# Altium schematic sheet BMS Carrier - Temperature Sense Interface.SchDoc: Current Sense isoSPI Interface
size Letter; Author: Taiping Li; Revision: 2.1; Website: www.uwmidsun.com; ProjectAuthor: Taiping Li
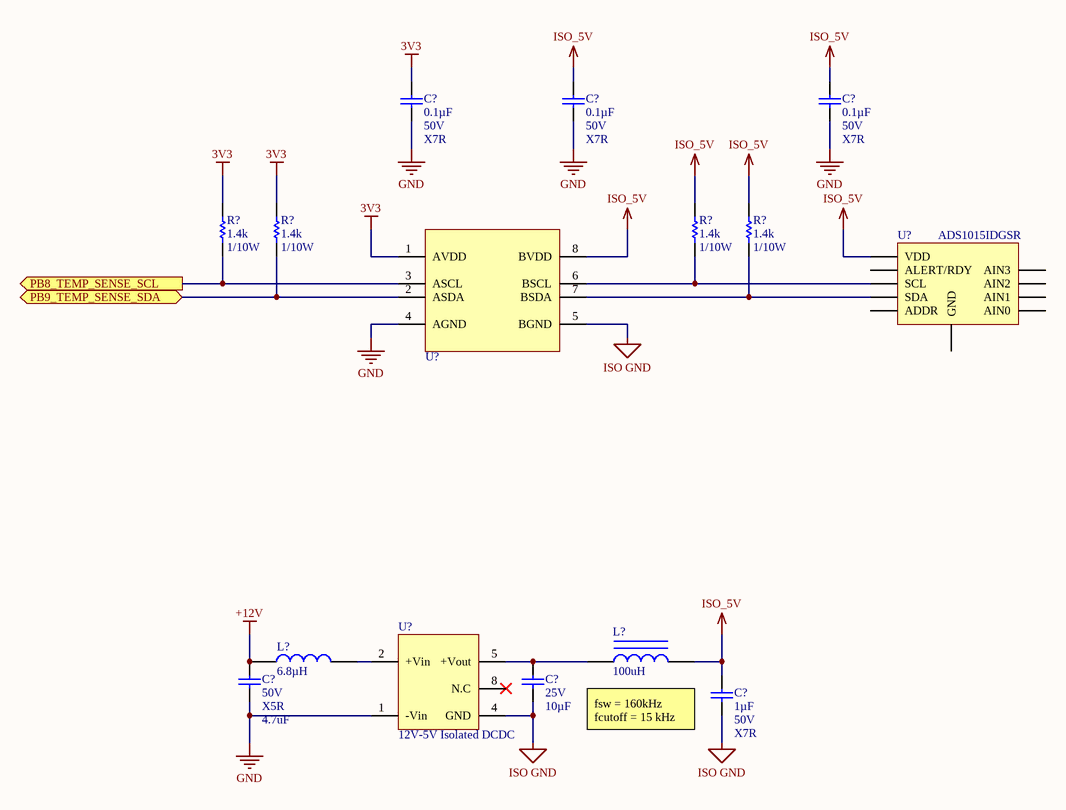
[diagram p0: BMS Carrier - Temperature Sense Interface.SchDoc]

## Parts
(Parts that share a designator on the sheet are numbered #1, #2 ... from top to bottom, then left to right.)
C?#1  Capacitance: 0.1µF  Voltage: 50V  Temperature Coefficient: X7R  [CAP, 0603]  (hidden comment: CAP CER 0.1UF 50V 10% X7R 0603)
C?#2  Capacitance: 0.1µF  Voltage: 50V  Temperature Coefficient: X7R  [CAP, 0603]  (hidden comment: CAP CER 0.1UF 50V 10% X7R 0603)
C?#3  Capacitance: 0.1µF  Voltage: 50V  Temperature Coefficient: X7R  [CAP, 0603]  (hidden comment: CAP CER 0.1UF 50V 10% X7R 0603)
C?#4  value 4.7uF  Voltage - Rated: 50V  Temperature Coefficient: X5R  [CAP, 0805]  (hidden comment: CAP CER 4.7UF 50V 10% X5R 0805)
C?#5  Voltage - Rated: 25V  Capacitance: 10µF  [CAP, 0805]  (hidden comment: CAP CER 10uF 25V 10% X5R 0805)
C?#6  Capacitance: 1µF  Voltage: 50V  Temperature Coefficient: X7R  [CAP, 0603]  (hidden comment: CAP CER 1UF 50V 10% X7R 0603)
L?#1  Inductance: 6.8µH  [NLFV32T-6R8M-EF/IND 6.8uH]  (hidden comment: IND 6.8uH 260mA 20% 1210)
L?#2  value 100uH  [1210]  (hidden comment: IND 100uH 60mA 5% 1210)
R?#1  Resistance: 1.4k  Power: 1/10W  [RES, 0603]  (hidden comment: RES 1.4k OHM 1% 1/10W 0603)
R?#2  Resistance: 1.4k  Power: 1/10W  [RES, 0603]  (hidden comment: RES 1.4k OHM 1% 1/10W 0603)
R?#3  Resistance: 1.4k  Power: 1/10W  [RES, 0603]  (hidden comment: RES 1.4k OHM 1% 1/10W 0603)
R?#4  Resistance: 1.4k  Power: 1/10W  [RES, 0603]  (hidden comment: RES 1.4k OHM 1% 1/10W 0603)
U?#1  IC DGTL ISO I2C 3.75KV 2CH 8SOIC  [IC DGTL ISO 3.75KV I2C 8SOIC NARROW BODY]  (value not drawn)
U?#2  ADS1015IDGSR  [IC ADC VSSOP10]
U?#3  12V-5V Isolated DCDC  [IC, Isolated DCDC]

## Ports
PB8_TEMP_SENSE_SCL (out), PB9_TEMP_SENSE_SDA (bidir)

## Nets
3V3: C?#1.1 R?#1.1 R?#2.1 U?#1.1(AVDD)
+12V: C?#4.1 L?#1.1
GND: C?#1.2 C?#2.2 C?#3.2 C?#4.2 U?#1.4(AGND) U?#3.1(-Vin)
ISO GND: C?#5.2 C?#6.2 U?#1.5(BGND) U?#3.4(GND)
ISO_5V: C?#2.1 C?#3.1 C?#6.1 L?#2.2 R?#3.1 R?#4.1 U?#1.8(BVDD) U?#2.8(VDD)
PB8_TEMP_SENSE_SCL: R?#1.2 U?#1.3(ASCL) ; port PB8_TEMP_SENSE_SCL
PB9_TEMP_SENSE_SDA: R?#2.2 U?#1.2(ASDA) ; port PB9_TEMP_SENSE_SDA
NetC?#5_1: C?#5.1 L?#2.1 U?#3.5(+Vout)
NetL?#1_2: L?#1.2 U?#3.2(+Vin)
NetR?#3_2: R?#3.2 U?#1.6(BSCL) U?#2.10(SCL)
NetR?#4_2: R?#4.2 U?#1.7(BSDA) U?#2.9(SDA)

Not connected (* = marked no-connect by the designer): U?#2 1(ADDR) 2(ALERT/RDY) 3(GND) 4(AIN0) 5(AIN1) 6(AIN2) 7(AIN3); U?#3 8(N.C)*

## Notes on the sheet
- fsw = 160kHz
  fcutoff = 15 kHz
- Project:
- Title:
- Size:
- Project Lead:
- Letter
- Revision:
- University of Waterloo
- 200 University Ave W
- Waterloo, ON, Canada
- N2L 3E9
- Date:
- Sheet
- of
- Website:

## Library data of the parts
C?#1-C?#3 = CAP CER 0.1UF 50V 10% X7R 0603: 0.10µF ±10% 50V Ceramic Capacitor X7R 0603 (1608 Metric); Manufacturer 1: AVX Corporation; Manufacturer Part Number 1: 06035C104KAT2A; Supplier 1: Digi-Key; Supplier Part Number 1: 478-5052-1-ND; Packaging: Cut Tape (CT); Part Status: Active; Operating Temperature: -55°C ~ 125°C; Ratings: -; Mounting Type: Surface Mount, MLCC; Package / Case: 0603 (1608 Metric); Size / Dimension: 0.063" L x 0.032" W (1.60mm x 0.81mm); Height - Seated (Max): -; Thickness (Max): 0.035" (0.90mm); Lead Spacing: -; Lead Style: -; ComponentLink1URL: http://datasheets.avx.com/X7RDielectric.pdf; ComponentLink1Description: http://datasheets.avx.com/X7RDielectric.pdf; Tolerance: ±10%
C?#4 = CAP CER 4.7UF 50V 10% X5R 0805: 4.7µF ±20% 50V Ceramic Capacitor X5R 0805 (2012 Metric); Manufacturer 1: Murata Electronics North America; Manufacturer Part Number 1: GRT21BR61H475ME13L; Description 1: CAP CER 4.7UF 50V X5R 0805; Supplier 1: Digi-Key; Supplier Part Number 1: 490-12395-1-ND; RoHS: RoHS Compliant; Category: Capacitors; Stock 1: 4286; Pricing 1: 1=0.56, 10=0.389, 100=0.2338, 500=0.17536, 1000=0.14808 (CAD); Packaging: Cut Tape (CT); Part Status: Active; Tolerance: ±20%; Operating Temperature: -55°C ~ 85°C; Features: -; Ratings: AEC-Q200; Applications: Automotive; Mounting Type: Surface Mount, MLCC; Package / Case: 0805 (2012 Metric); Size / Dimension: 0.079" L x 0.049" W (2.00mm x 1.25mm); Height - Seated (Max): -; Thickness (Max): 0.057" (1.45mm); Lead Spacing: -; Lead Style: -; ComponentLink1URL: http://search.murata.co.jp/Ceramy/image/img/A01X/G101/ENG/GRT21BR61H475ME13-01.pdf; ComponentLink1Description: http://search.murata.co.jp/Ceramy/image/img/A01X/G101/ENG/GRT21BR61H475ME13-01.pdf
C?#5 = CAP CER 10uF 25V 10% X5R 0805: 10µF ±10% 25V Ceramic Capacitor X5R 0805 (2012 Metric); Manufacturer: Murata Electronics North America; Manufacturer Part Number: GRM21BR61E106KA73L; Supplier 1: Digi-Key; RoHS: RoHS Compliant; Category: Capacitors; Stock 1: 1695157; Packaging: Cut Tape (CT); Part Status: Active; Tolerance: ±10%; Temperature Coefficient: X5R; Operating Temperature: -55°C ~ 85°C; Features: -; Ratings: -; Applications: General Purpose; Mounting Type: Surface Mount, MLCC; Package / Case: 0805 (2012 Metric); Size / Dimension: 0.079" L x 0.049" W (2.00mm x 1.25mm); Height - Seated (Max): -; Thickness (Max): 0.053" (1.35mm); Lead Spacing: -; Lead Style: -; ComponentLink1URL: http://search.murata.co.jp/Ceramy/image/img/A01X/G101/ENG/GRM21BR61E106KA73-01.pdf; ComponentLink1Description: http://search.murata.co.jp/Ceramy/image/img/A01X/G101/ENG/GRM21BR61E106KA73-01.pdf; Supplier Part Number 1: 490-5523-1-ND; Pricing 1: 1=0.3, 10=0.214, 100=0.1008, 500=0.07068, 1000=0.05851 (CAD)
C?#6 = CAP CER 1UF 50V 10% X7R 0603: 1µF ±10% 50V Ceramic Capacitor X7R 0603 (1608 Metric); Manufacturer 1: Taiyo Yuden; Manufacturer Part Number 1: UMK107AB7105KA-T; Supplier 1: Digi-Key; Supplier Part Number 1: 587-3247-1-ND; Packaging: Cut Tape (CT); Part Status: Active; Operating Temperature: -55°C ~ 125°C; Ratings: -; Mounting Type: Surface Mount, MLCC; Package / Case: 0603 (1608 Metric); Size / Dimension: 0.063" L x 0.031" W (1.60mm x 0.80mm); Height - Seated (Max): -; Thickness (Max): 0.037" (0.95mm); Lead Spacing: -; Lead Style: -; ComponentLink1URL: http://www.yuden.co.jp/productdata/catalog/en/mlcc_all_e.pdf; ComponentLink1Description: http://www.yuden.co.jp/productdata/catalog/en/mlcc_all_e.pdf; Tolerance: ±10%
L?#1 = IND 6.8uH 260mA 20% 1210: 6.8µH Shielded Wirewound Inductor 260mA 204 mOhm Max 1210 (3225 Metric); Manufacturer 1: TDK Corporation; Manufacturer Part Number 1: NLFV32T-6R8M-EF; Material - Core: Ferrite; Supplier 1: Digi-Key; Supplier Part Number 1: 445-15776-1-ND; Packaging: Cut Tape (CT); Part Status: Active; Type: Wirewound; Current Rating: 260mA; Current - Saturation: -; Shielding: Shielded; DC Resistance (DCR): 204 mOhm Max; Q @ Freq: -; Frequency - Self Resonant: -; Ratings: -; Operating Temperature: -40°C ~ 105°C; Mounting Type: Surface Mount; Package / Case: 1210 (3225 Metric); Supplier Device Package: 1210 (3225 Metric); Size / Dimension: 0.126" L x 0.098" W (3.20mm x 2.50mm); Height - Seated (Max): 0.094" (2.40mm); ComponentLink1URL: https://product.tdk.com/info/en/catalog/datasheets/inductor_commercial_decoupling_nlfv32-ef_en.pdf; ComponentLink1Description: https://product.tdk.com/info/en/catalog/datasheets/inductor_commercial_decoupling_nlfv32-ef_en.pdf; Tolerance: ±20%
L?#2 = IND 100uH 60mA 5% 1210: 100µH Unshielded Wirewound Inductor 60mA 11 Ohm Max 1210 (3225 Metric); Manufacturer: EPCOS (TDK); Manufacturer Part Number: B82422T1104J000; Material - Core: Ferrite; Q @ Freq: 20 @ 796kHz; Supplier 1: Digi-Key; RoHS: RoHS Compliant; Category: Inductors, Coils, Chokes; Stock 1: 4846; Pricing 1: 1=0.65, 10=0.568, 100=0.4062, 500=0.3412, 1000=0.27621 (CAD); Packaging: Cut Tape (CT); Part Status: Active; Type: Wirewound; Tolerance: ±5%; Shielding: Unshielded; DC Resistance (DCR): 11 Ohm Max; Ratings: AEC-Q200; Operating Temperature: -55°C ~ 125°C; Mounting Type: Surface Mount; Package / Case: 1210 (3225 Metric); Supplier Device Package: 1210 (3225 Metric); Size / Dimension: 0.126" L x 0.098" W (3.20mm x 2.50mm); Height - Seated (Max): 0.083" (2.10mm); ComponentLink1URL: https://en.tdk.eu/inf/30/db/ind_2008/b82422t.pdf; ComponentLink1Description: https://en.tdk.eu/inf/30/db/ind_2008/b82422t.pdf; Supplier Part Number 1: 495-5646-1-ND
R?#1-R?#4 = RES 1.4k OHM 1% 1/10W 0603: RES SMD 1.4K OHM 1% 1/10W 0603; Manufacturer 1: Yageo; Manufacturer Part Number 1: RC0603FR-071K4L; Temperature Coefficient: ±100ppm/°C; Supplier 1: Digi-Key; Supplier Part Number 1: 311-1.40KHRCT-ND; Packaging: Cut Tape (CT); Part Status: Active; Composition: Thick Film; Operating Temperature: -55°C ~ 155°C; Package / Case: 0603 (1608 Metric); Supplier Device Package: 0603; Size / Dimension: 0.063" L x 0.031" W (1.60mm x 0.80mm); Height - Seated (Max): 0.022" (0.55mm); Failure Rate: -; ComponentLink1URL: http://www.yageo.com/documents/recent/PYu-RC_Group_51_RoHS_L_7.pdf; ComponentLink1Description: http://www.yageo.com/documents/recent/PYu-RC_Group_51_RoHS_L_7.pdf; Tolerance: ±1%
U?#1 = IC DGTL ISO I2C 3.75KV 2CH 8SOIC: I²C Digital Isolator 3750Vrms 2 Channel 35kV/µs CMTI 8-SOIC (0.154", 3.90mm Width); Manufacturer 1: Silicon Labs; Manufacturer Part Number 1: SI8600AC-B-ISR; Number of Channels: 2; Data Rate: 10Mbps; Propagation Delay: 26ns; Channel Type: Bidirectional; Isolated Power: No; Pulse Width Distortion (PWD): 32ns; Supplier 1: Digi-Key; Supplier Part Number 1: SI8600AC-B-ISRCT-ND; Stock 1: 4033; Pricing 1: 1=3.33, 25=3.2084, 100=3.0849 (USD); Case/Package: SOIC; Number of Pins: 8; Weight: 0.006596oz; Min Operating Temperature: -40°C; Max Operating Temperature: 125°C; Package Quantity: 2500; Packaging: Tape and Reel; Polarity: Bidirectional; ComponentLink1URL: https://datasheet.ciiva.com/14921/supportdocuments2ftechnicaldocs2fsi860x-14921653.pdf; ComponentLink1Description: https://datasheet.ciiva.com/14921/supportdocuments2ftechnicaldocs2fsi860x-14921653.pdf
U?#2 = IC ADC 12-BIT VSSOP-10: 12 Bit Analog to Digital Converter 4 Input 1 Sigma-Delta 10-VSSOP; Manufacturer: Texas Instruments; Number of Bits: 12; Sampling Rate (Per Second): 3.3k; Number of Inputs: 2, 4; Input Type: Differential, Single Ended; Data Interface: I²C; Configuration: MUX-PGA-ADC; Number of A/D Converters: 1; Reference Type: Internal; Voltage - Supply, Analog: 2 V ~ 5.5 V; Supplier 1: Digi-Key; Manufacturer Part Number: ADS1015IDGSR; RoHS: RoHS Compliant; Category: Integrated Circuits (ICs); Stock 1: 4084; Pricing 1: 1=4.25, 10=3.807, 100=3.1194, 500=2.65552, 1000=2.23959 (CAD); Packaging: Cut Tape (CT); Part Status: Active; Ratio - S/H:ADC: -; Architecture: Sigma-Delta; Voltage - Supply, Digital: 2 V ~ 5.5 V; Features: PGA, Selectable Address; Operating Temperature: -40°C ~ 125°C; Package / Case: 10-TFSOP, 10-MSOP (0.118", 3.00mm Width); Supplier Device Package: 10-VSSOP; ComponentLink1URL: http://www.ti.com/lit/ds/symlink/ads1013.pdf; ComponentLink1Description: http://www.ti.com/lit/ds/symlink/ads1013.pdf; Supplier Part Number 1: 296-41185-1-ND
U?#3 = IC DCDC ISOLATED 12V-5V 1W 8-SMD 5-LEAD: Isolated Module DC DC Converter 1 Output 5V 200mA 10.8V - 13.2V Input; Manufacturer 1: XP Power; Manufacturer Part Number 1: ISE1205A; Description 1: DC/DC CONV 5V 1W; Efficiency: 80%; Supplier 1: Digi-Key; Supplier Part Number 1: 1470-2948-1-ND; RoHS: RoHS Compliant; Category: Power Supplies - Board Mount; Stock 1: 774; Pricing 1: 1=6.52, 5=6.322, 10=6.126, 25=5.8652, 100=5.4739 (CAD); Packaging: Cut Tape (CT); Part Status: Active; Type: Isolated Module; Voltage - Input (Min): 10.8V; Voltage - Input (Max): 13.2V; Voltage - Output 1: 5V; Voltage - Output 2: -; Voltage - Output 3: -; Current - Output (Max): 200mA; Applications: ITE (Commercial); Features: SCP; Operating Temperature: -40°C ~ 105°C; Mounting Type: Surface Mount; Package / Case: 8-SMD Module, 5 Leads; Size / Dimension: 0.50" L x 0.44" W x 0.29" H (12.7mm x 11.2mm x 7.3mm); ComponentLink1URL: http://www.xppower.com/Portals/0/pdfs/SF_ISE.pdf; ComponentLink1Description: http://www.xppower.com/Portals/0/pdfs/SF_ISE.pdf